# Altium schematic sheet Sound.SchDoc
size A4; SheetNumber: 7; SheetTotal: 11
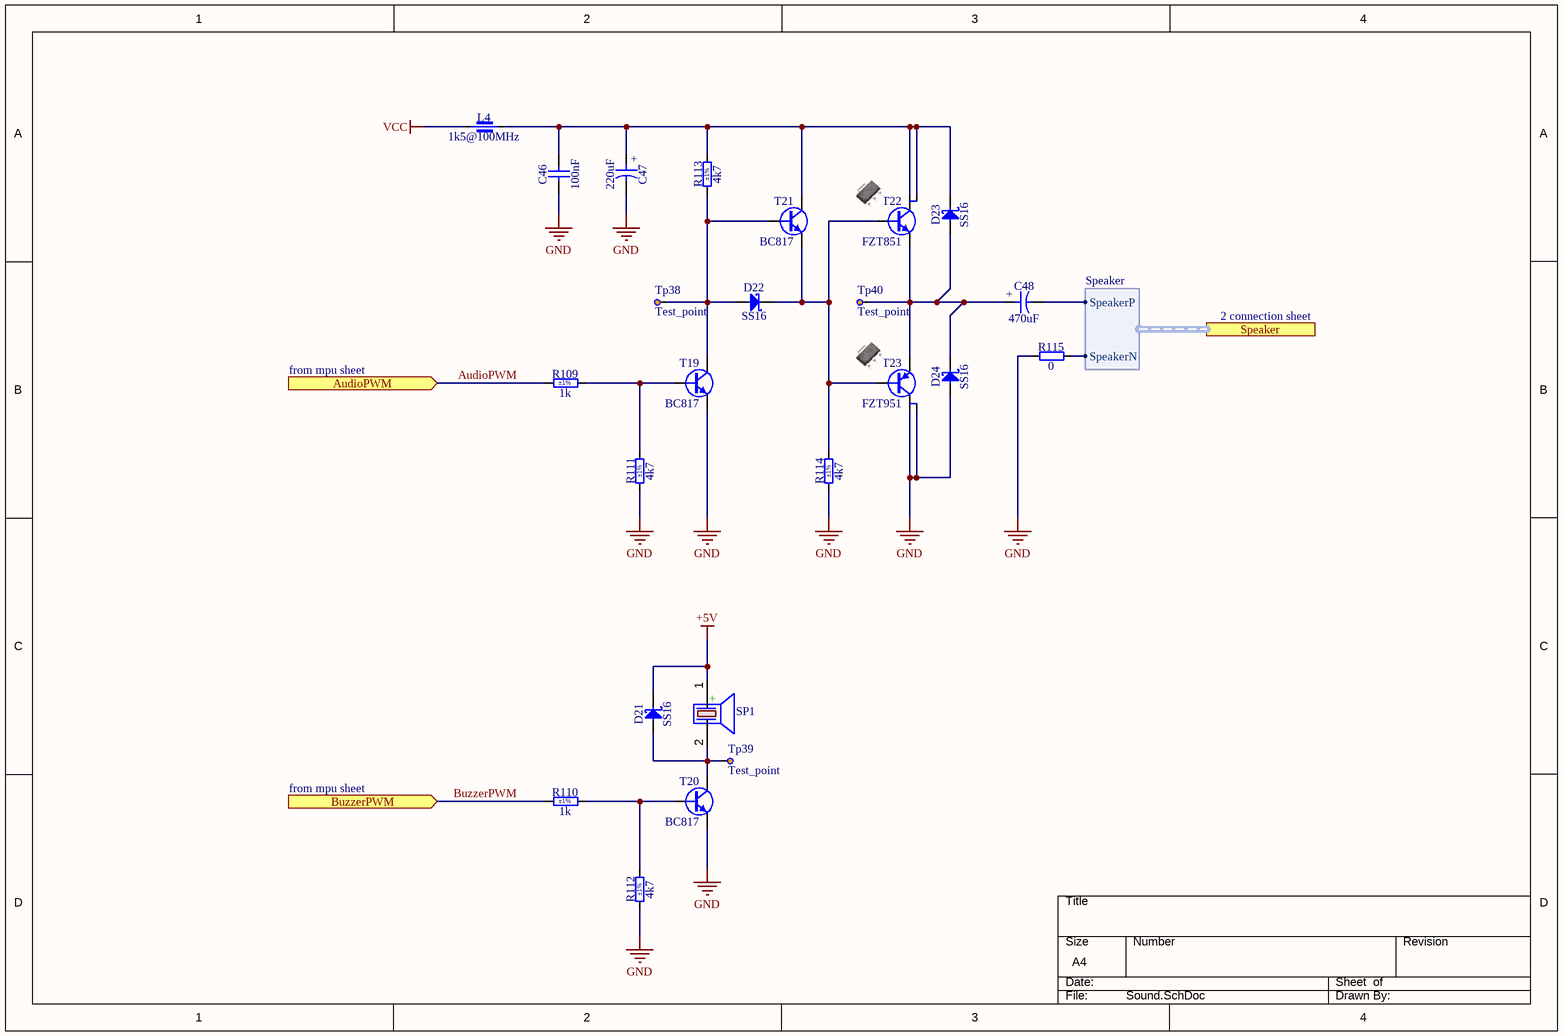
[diagram p0: Sound.SchDoc]

## Parts
C46  100nF  [CAPC3216X140N]
C47  220uF  [CAPAE830X1020N]
C48  470uF  [CAPPR500-1050X1750]
D21  SS16  [DIOM5127X229N]
D22  SS16  [DIOM5127X229N]
D23  SS16  [DIOM5127X229N]
D24  SS16  [DIOM5127X229N]
L4  1k5@100MHz  [INDC2012X110N]
R109  1k  Tolerance: ±1%  [RESC1608X55N]
R110  1k  Tolerance: ±1%  [RESC1608X55N]
R111  4k7  Tolerance: ±1%  [RESC1608X55N]
R112  4k7  Tolerance: ±1%  [RESC1608X55N]
R113  4k7  Tolerance: ±1%  [RESC3216X65N]
R114  4k7  Tolerance: ±1%  [RESC3216X65N]
R115  0  [RESC1608X55N]
SP1  (no value)  [BUZZER 7.62mm DC]
T19  BC817  [SOT95P230X110-3N]
T20  BC817  [SOT95P230X110-3N]
T21  BC817  [SOT95P230X110-3N]
T22  FZT851  [SOT230P700X180-4N]
T23  FZT951  [SOT230P700X180-4N]
Tp38  Test_point  [TP_C40]
Tp39  Test_point  [TP_C40]
Tp40  Test_point  [TP_C40]

## Ports
AudioPWM (in), BuzzerPWM (in), Speaker (harness Speaker)

## Harnesses
Speaker: SpeakerP, SpeakerN

## Nets
+5V: D21.1(C) SP1.1(+)
GND: C46.1 C47.2 D24.2(A) R111.1 R112.1 R114.1 R115.1 T19.2(E) T20.2(E) T23.2(C) T23.4(C)
VCC: L4.1
AudioPWM: R109.1 ; port AudioPWM
BuzzerPWM: R110.1 ; port BuzzerPWM
NetC46_2: C46.2 C47.1 D23.1(C) L4.2 R113.2 T21.3(C) T22.2(C) T22.4(C)
NetC48_1: C48.1 D23.2(A) D24.1(C) T22.3(E) T23.3(E) Tp40.1
NetC48_2: C48.2 ; port Speaker.SpeakerP
NetD21_2: D21.2(A) SP1.2(-) T20.3(C) Tp39.1
NetD22_1: D22.1(C) R114.2 T21.2(E) T22.1(B) T23.1(B)
NetD22_2: D22.2(A) R113.1 T19.3(C) T21.1(B) Tp38.1
NetR109_2: R109.2 R111.2 T19.1(B)
NetR110_2: R110.2 R112.2 T20.1(B)
NetR115_2: R115.2 ; port Speaker.SpeakerN

## Notes on the sheet
- 2 connection sheet
- from mpu sheet
- THIS DOCUMENT AND THE DATA DISCLOSED HEREIN OR
- HEREWITH IS THE PROPERTY OF ALTIUM LIMITED AND MAY
- DWG NO:
- REVISION
- REV:
- DESCRIPTION
- DATE
- APPROVED
- BE FREELY DISTRIBUTED IN WHOLE. NO RIGHTS ARE
- RESERVED OR EXPRESS OR IMPLIED WARANTEE GIVEN.
- ENG:
- APPROVALS
- PROJECT
- DSN:
- CHK:
- REFERENCE DOCUMENTS
- PROJECT REVISION:
- TITLE
- DOCUMENT REVISION:
- DESIGN ITEM:
- BOM:
- FAB DWG:
- PCB DWG:
- ASSY DWG:
- SCALE:
- A3
- SIZE
- CAGE CODE
- FILE NAME
- DWG NO.
- SHEET
- OF
- REV
- (in symbol CAE830-1020_220UF_50V_20%) +
- (in symbol CAER_470UF_35V_20%_VISHAY_MAL203850471E3) +

## Library data of the parts
C46 = CC1206_100NF_100V_10%_X7R: Non-polarised capacitor; Part Description: SMD Multilayer Chip Ceramic Capacitor; Manufacturer: GENERIC; Manufacturer1 Part Number: 222260115649; Voltage: 100V; TC: X7R; Tolerance: ±10%; Part Number: CC1206_100NF_100V_10%_X7R; Component Kind: Standard; Component Type: Standard; Pin Count: 2; Value: 100nF; Status: Preferred; Manufacturer Part Number: CC1206_100NF_100V_10%_X7R; Case: 1206; Mounted: Yes; Socket: No; SMD: Yes; Sense: No; Manufacturer1 Example: PHYCOMP; Manufacturer1 ComponentHeight: 1.25mm; HelpURL: \\cern.ch\dfs\Applications\Altium\Datasheets\CC1206_X7R_PHYCOMP.pdf; Author: CERN DEM JLC; CreateDate: 24.08.2009; LatestRevisionDate: 24.08.2009
C47 = CAE830-1020_220UF_50V_20%: Polarised capacitor; Part Description: Aluminum Electrolytic SMT Capacitor; Manufacturer: PANASONIC; Manufacturer Part Number: EEEFT1H221AP; Voltage: 50V; Tolerance: ±20%; Part Number: CAE830-1020_220UF_50V_20%; Component Kind: Standard; Component Type: Standard; Pin Count: 2; Value: 220uF; Status: Not Recommended; Case: F; Mounted: Yes; Socket: No; SMD: Yes; Sense: No; ComponentHeight: 10.2mm; HelpURL: \\cern.ch\dfs\Applications\Altium\Datasheets\CAE_PANASONIC_FT.pdf; Author: CERN DEM BC; CreateDate: 12.04.2021; LatestRevisionDate: 12.04.2021
C48 = CAER_470UF_35V_20%_VISHAY_MAL203850471E3: Polarised capacitor; Part Description: Radial Standard Ultra Miniature Aluminum Electrolytic Capacitor (038 RSU Series); Manufacturer: VISHAY BCCOMPONENTS; Voltage: 35V; Tolerance: ±20%; Part Number: CAER_470UF_35V_20%_VISHAY_MAL203850471E3; Component Kind: Standard; Component Type: Standard; Pin Count: 2; Value: 470uF; Status: None; Manufacturer Part Number: MAL203850471E3; Case: LS5 D10.5 x H17.5; Mounted: Yes; Socket: No; SMD: No; Sense: No; ComponentHeight: 13.5mm; HelpURL: \\cern.ch\dfs\Applications\Altium\Datasheets\CAER_VISHAY_038 RSU.pdf; Author: CERN DEM JLC; CreateDate: 11.04.2012; LatestRevisionDate: 11.04.2012
D21-D24 = SS16: Schottky Diode; Part Description: Surface Mount Schottky Barrier Rectifier; Manufacturer: VISHAY GENERAL SEMICONDUCTOR; Voltage: 60V; Power: 1A; PressFit: No; Bonding: No; Part Number: SS16; Component Kind: Standard; Component Type: Standard; Device: SS16; PackageDescription: DO-214-AC/SMA Diode, Molded Body; 5.10mm L X 2.67mm W X 2.29mm H, IPC Medium Density; Manufacturer Part Number: SS16; Pin Count: 2; Case: DO-214AC; Mounted: Yes; Socket: No; SMD: Yes; Sense: No; ComponentHeight: 2.29mm; HelpURL: \\cern.ch\dfs\Applications\Altium\Datasheets\SS16.pdf; Author: CERN DEM JLC; CreateDate: 15.07.2008; LatestRevisionDate: 23.08.2010
L4 = IND0805_WURTH_742792097: Part Description: SMD EMI Suppression Chip Ferrite Bead (WE-CBF Series); Manufacturer: WURTH ELEKTRONIK; Power: 1A; Resistance: 0.3R; Tolerance: ±25%; Part Number: IND0805_WURTH_742792097; Component Kind: Standard; Component Type: Standard; Pin Count: 2; Value: 1k5@100MHz; Manufacturer Part Number: 742792097; Case: 0805; Mounted: Yes; Socket: No; SMD: Yes; Sense: No; ComponentHeight: 1.1mm; HelpURL: \\cern.ch\dfs\Applications\Altium\Datasheets\IND0805_WURTH_742792097.pdf; Author: CERN DEM MR; CreateDate: 29.06.2017; LatestRevisionDate: 25.10.2018
R109 R110 = R0603_1K_1%_0.1W_100PPM: Resistor - 1%; Part Description: General Purpose Thick Film Chip Resistor; Manufacturer: GENERIC; Manufacturer1 Part Number: NRC06F1001TRF; Power: 0.1W; TC: ±100ppm/°C; PressFit: No; Part Number: R0603_1K_1%_0.1W_100PPM; Component Kind: Standard; Component Type: Standard; Pin Count: 2; Value: 1k; Status: Preferred; Manufacturer Part Number: R0603_1K_1%_0.1W_100PPM; Case: 0603; Mounted: Yes; Sense: No; Socket: No; SMD: Yes; Manufacturer1 Example: NIC COMPONENT; Manufacturer1 ComponentHeight: 0.55mm; HelpURL: \\cern.ch\dfs\Applications\Altium\Datasheets\R0603_NIC_NRC.pdf; Author: CERN DEM JLC; CreateDate: 03.12.2007; LatestRevisionDate: 13.03.2008
R111 R112 = R0603_4K7_1%_0.1W_100PPM: Resistor - 1%; Part Description: General Purpose Thick Film Chip Resistor; Manufacturer: GENERIC; Manufacturer1 Part Number: NRC06F4701TRF; Power: 0.1W; TC: ±100ppm/°C; PressFit: No; Part Number: R0603_4K7_1%_0.1W_100PPM; Component Kind: Standard; Component Type: Standard; Pin Count: 2; Value: 4k7; Status: Preferred; Manufacturer Part Number: R0603_4K7_1%_0.1W_100PPM; Case: 0603; Mounted: Yes; Sense: No; Socket: No; SMD: Yes; Manufacturer1 Example: NIC COMPONENT; Manufacturer1 ComponentHeight: 0.55mm; HelpURL: \\cern.ch\dfs\Applications\Altium\Datasheets\R0603_NIC_NRC.pdf; Author: CERN DEM JLC; CreateDate: 03.12.2007; LatestRevisionDate: 13.03.2008
R113 R114 = R1206_4K7_1%_0.25W_100PPM: Resistor - 1%; Part Description: General Purpose Thick Film Chip Resistor; Manufacturer: GENERIC; Manufacturer1 Part Number: NRC12F4701TRF; Power: 0.25W; TC: ±100ppm/°C; PressFit: No; Part Number: R1206_4K7_1%_0.25W_100PPM; Component Kind: Standard; Component Type: Standard; Pin Count: 2; Value: 4k7; Status: Preferred; Manufacturer Part Number: R1206_4K7_1%_0.25W_100PPM; Case: 1206; Mounted: Yes; Sense: No; Socket: No; SMD: Yes; Manufacturer1 Example: NIC COMPONENT; Manufacturer1 ComponentHeight: 0.65mm; HelpURL: \\cern.ch\dfs\Applications\Altium\Datasheets\R1206_NIC_NRC.pdf; Author: CERN DEM JLC; CreateDate: 03.12.2007; LatestRevisionDate: 13.03.2008
R115 = R0603_0R_JUMPER: Resistor; Part Description: 1A (0.05R Max DC Resistance) Zero Ohm Jumper; Manufacturer: GENERIC; Manufacturer1 Part Number: NRC06Z0; PressFit: No; Part Number: R0603_0R_JUMPER; Component Kind: Standard; Component Type: Standard; Pin Count: 2; Value: 0; Status: Preferred; Manufacturer Part Number: R0603_0R_JUMPER; Case: 0603; Mounted: Yes; Sense: No; Socket: No; SMD: Yes; Manufacturer1 Example: NIC COMPONENT; Manufacturer1 ComponentHeight: 0.55mm; HelpURL: \\cern.ch\dfs\Applications\Altium\Datasheets\R0603_NIC_NRC.pdf; Author: CERN DEM JLC; CreateDate: 03.12.2007; LatestRevisionDate: 13.03.2008
SP1 = PIEZO BUZZER: PIEZO BUZZER ACTIVE; Designer: Abbas Basereh; Comment_1: SPEAKER AND BEEP; Design Date: 1395/11/14; ComponentLink2Description: Reference; PackageDescription: THD; Publisher: Abbas Basereh; Mounting Technology: THD; Pin Count: 2; Status: Unreleased
T19-T21 = BC817: NPN Transistor; Part Description: 45V 500mA NPN General-Purpose Transistor; Manufacturer: NXP SEMICONDUCTORS; PressFit: No; Bonding: No; Part Number: BC817; Component Kind: Standard; Component Type: Standard; Device: BC817; PackageDescription: SOT23, 0.95mm Pitch; 3 Pin, 1.30mm W X 2.90mm L X 1.10mm H body, IPC Medium Density; Manufacturer Part Number: BC817; Pin Count: 3; Case: SOT23-3; Mounted: Yes; Socket: No; SMD: Yes; Sense: No; ComponentHeight: 1.1mm; HelpURL: \\cern.ch\dfs\Applications\Altium\Datasheets\BC817.pdf; Author: CERN DEM JLC; CreateDate: 12.05.2011; LatestRevisionDate: 12.05.2011
T22 = FZT851: NPN Transistor; Part Description: 60V 6A NPN Silicon Planar High Current Transistor; Manufacturer: ZETEX SEMICONDUCTORS; PressFit: No; Bonding: No; Part Number: FZT851; Component Kind: Standard; Component Type: Standard; Device: FZT851; PackageDescription: SOT223, 2.30mm Pitch; 4 Pin, 3.70mm W X 6.70mm L X 1.80mm H body, IPC Medium Density; Manufacturer Part Number: FZT851; Pin Count: 4; Case: SOT223; Mounted: Yes; Socket: No; SMD: Yes; Sense: No; ComponentHeight: 1.8mm; HelpURL: \\cern.ch\dfs\Applications\Altium\Datasheets\FZT851.pdf; Author: CERN DEM JLC; CreateDate: 16.07.2008; LatestRevisionDate: 16.07.2008
T23 = FZT951: PNP Transistor; Part Description: 60V 5A PNP Silicon Planar High Current Transistor; Manufacturer: ZETEX SEMICONDUCTORS; PressFit: No; Bonding: No; Part Number: FZT951; Component Kind: Standard; Component Type: Standard; Device: FZT951; PackageDescription: SOT223, 2.30mm Pitch; 4 Pin, 3.70mm W X 6.70mm L X 1.80mm H body, IPC Medium Density; Manufacturer Part Number: FZT951; Pin Count: 4; Case: SOT223; Mounted: Yes; Socket: No; SMD: Yes; Sense: No; ComponentHeight: 1.8mm; HelpURL: \\cern.ch\dfs\Applications\Altium\Datasheets\FZT951.pdf; Author: CERN DEM JLC; CreateDate: 16.07.2008; LatestRevisionDate: 16.07.2008
Tp38-Tp40 = Test point: Published: 8-Jun-2000; LatestRevisionDate: 17-Jul-2002; LatestRevisionNote: Re-released for DXP Platform.; PackageReference: AXIAL-0.3; Publisher: Altium Limited